# Altium project PCB_DongcoBai2.PrjPcb
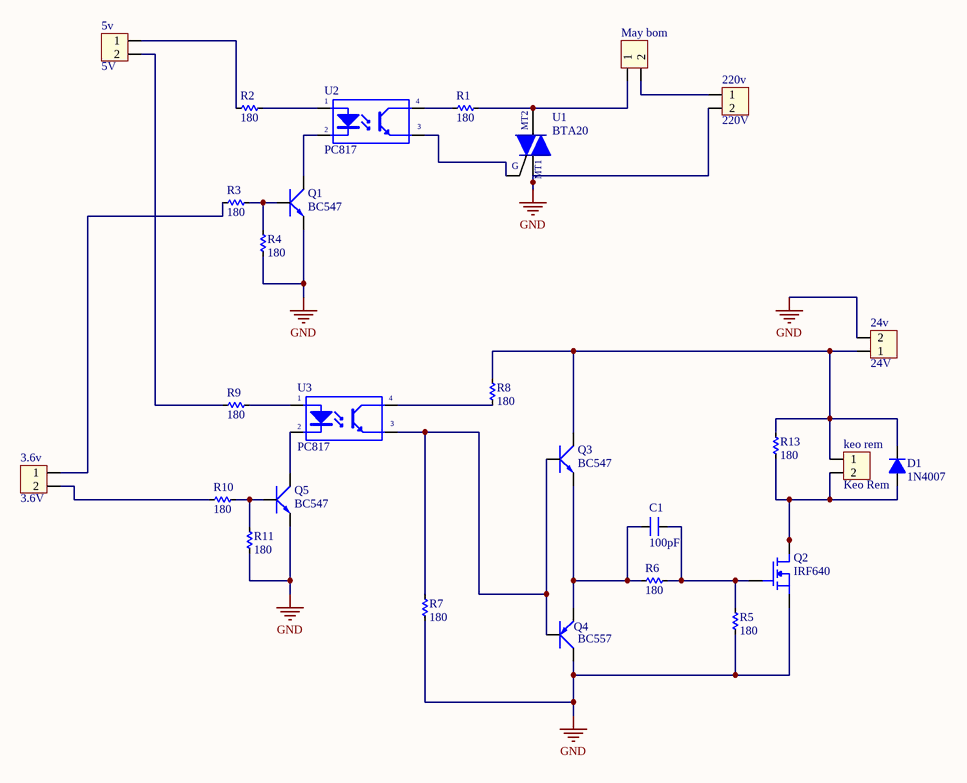
[diagram p0: Sheet2.SchDoc]
1 sheet, 28 parts. Net scope: global (net labels, ports and power ports of the same name join across sheets).
Board file: PCBchung.PcbDoc

## Sheet Sheet2.SchDoc
size A; SheetNumber: 1; SheetTotal: 1

### Parts
3.6v  3.6V  [HED2]
5v  5V  [HED2]
24v  24V  [HED2]
220v  220V  [HED2]
C1  100pF  [CN1]
D1  1N4007  [D1A]
keo_rem  Keo Rem  [HED2]
May_bom  (no value)  [HED2]
Q1  BC547  [QTO-92]
Q2  IRF640  [TO220AB]
Q3  BC547  [QTO-92]
Q4  BC557  [QTO-92]
Q5  BC547  [QTO-92]
R1  180  [RES-1/2W]
R2  180  [RES-1/2W]
R3  180  [RES-1/2W]
R4  180  [RES-1/2W]
R5  180  [RES-1/2W]
R6  180  [RES-1/2W]
R7  180  [RES-1/2W]
R8  180  [RES-1/2W]
R9  180  [RES-1/2W]
R10  180  [RES-1/2W]
R11  180  [RES-1/2W]
R13  180  [RES-1/2W]
U1  BTA20  [TO-220MAX]
U2  PC817  [DIP4]
U3  PC817  [DIP4]

### Nets
GND: 24v.2 220v.2 Q1.1(E) Q2.3(S) Q4.3(C) Q5.1(E) R4.1 R5.1 R7.1 R11.1 U1.1(MT1)
Net3.6v_1: 3.6v.1 R3.1
Net3.6v_2: 3.6v.2 R10.1
Net5v_1: 5v.1 R2.1
Net5v_2: 5v.2 R9.1
Net24v_1: 24v.1 D1.2(K) keo_rem.1 Q3.3(C) R8.2 R13.2
Net220v_1: 220v.1 May_bom.2
NetC1_1: C1.1 Q3.1(E) Q4.1(E) R6.1
NetC1_2: C1.2 Q2.1(G) R5.2 R6.2
NetD1_1: D1.1(A) keo_rem.2 Q2.2(D) R13.1
NetMay_bom_1: May_bom.1 R1.2 U1.2(MT2)
NetQ1_2: Q1.2(B) R3.2 R4.2
NetQ1_3: Q1.3(C) U2.2(K)
NetQ3_2: Q3.2(B) Q4.2(B) R7.2 U3.3(E)
NetQ5_2: Q5.2(B) R10.2 R11.2
NetQ5_3: Q5.3(C) U3.2(K)
NetR1_1: R1.1 U2.4(C)
NetR2_2: R2.2 U2.1(A)
NetR8_1: R8.1 U3.4(C)
NetR9_2: R9.2 U3.1(A)
NetU1_3: U1.3(IN) U2.3(E)

### Notes on the sheet
- (in symbol BTA20) G

### Library data of the parts
3.6v 5v 24v 220v keo_rem May_bom = Hed2: Header 2 (Green); Value: Header 2
C1 = CN1: Cap np  1pF - 472pF; Value: 100pF
D1 = D1A: Diode 1A; Value: 1N4007
Q1 Q3 Q5 = NPN_EBC: P 600mW, EBC; Value: C9014
Q4 = PNP_EBC: P 600mW, EBC; Value: C9015
R1-R11 R13 = Res: Manufacturer: Generic Components; Class: Passive; SubClass: R; Published: 08/06/2000; Publisher: Altium Hobart Technology Centre
U1 = BTA20: Triacs - 20A
U2 U3 = PC817: Single Opto; Value: PC817